# EAGLE design SDI12IB_v0.3 (EAGLE 5.11)
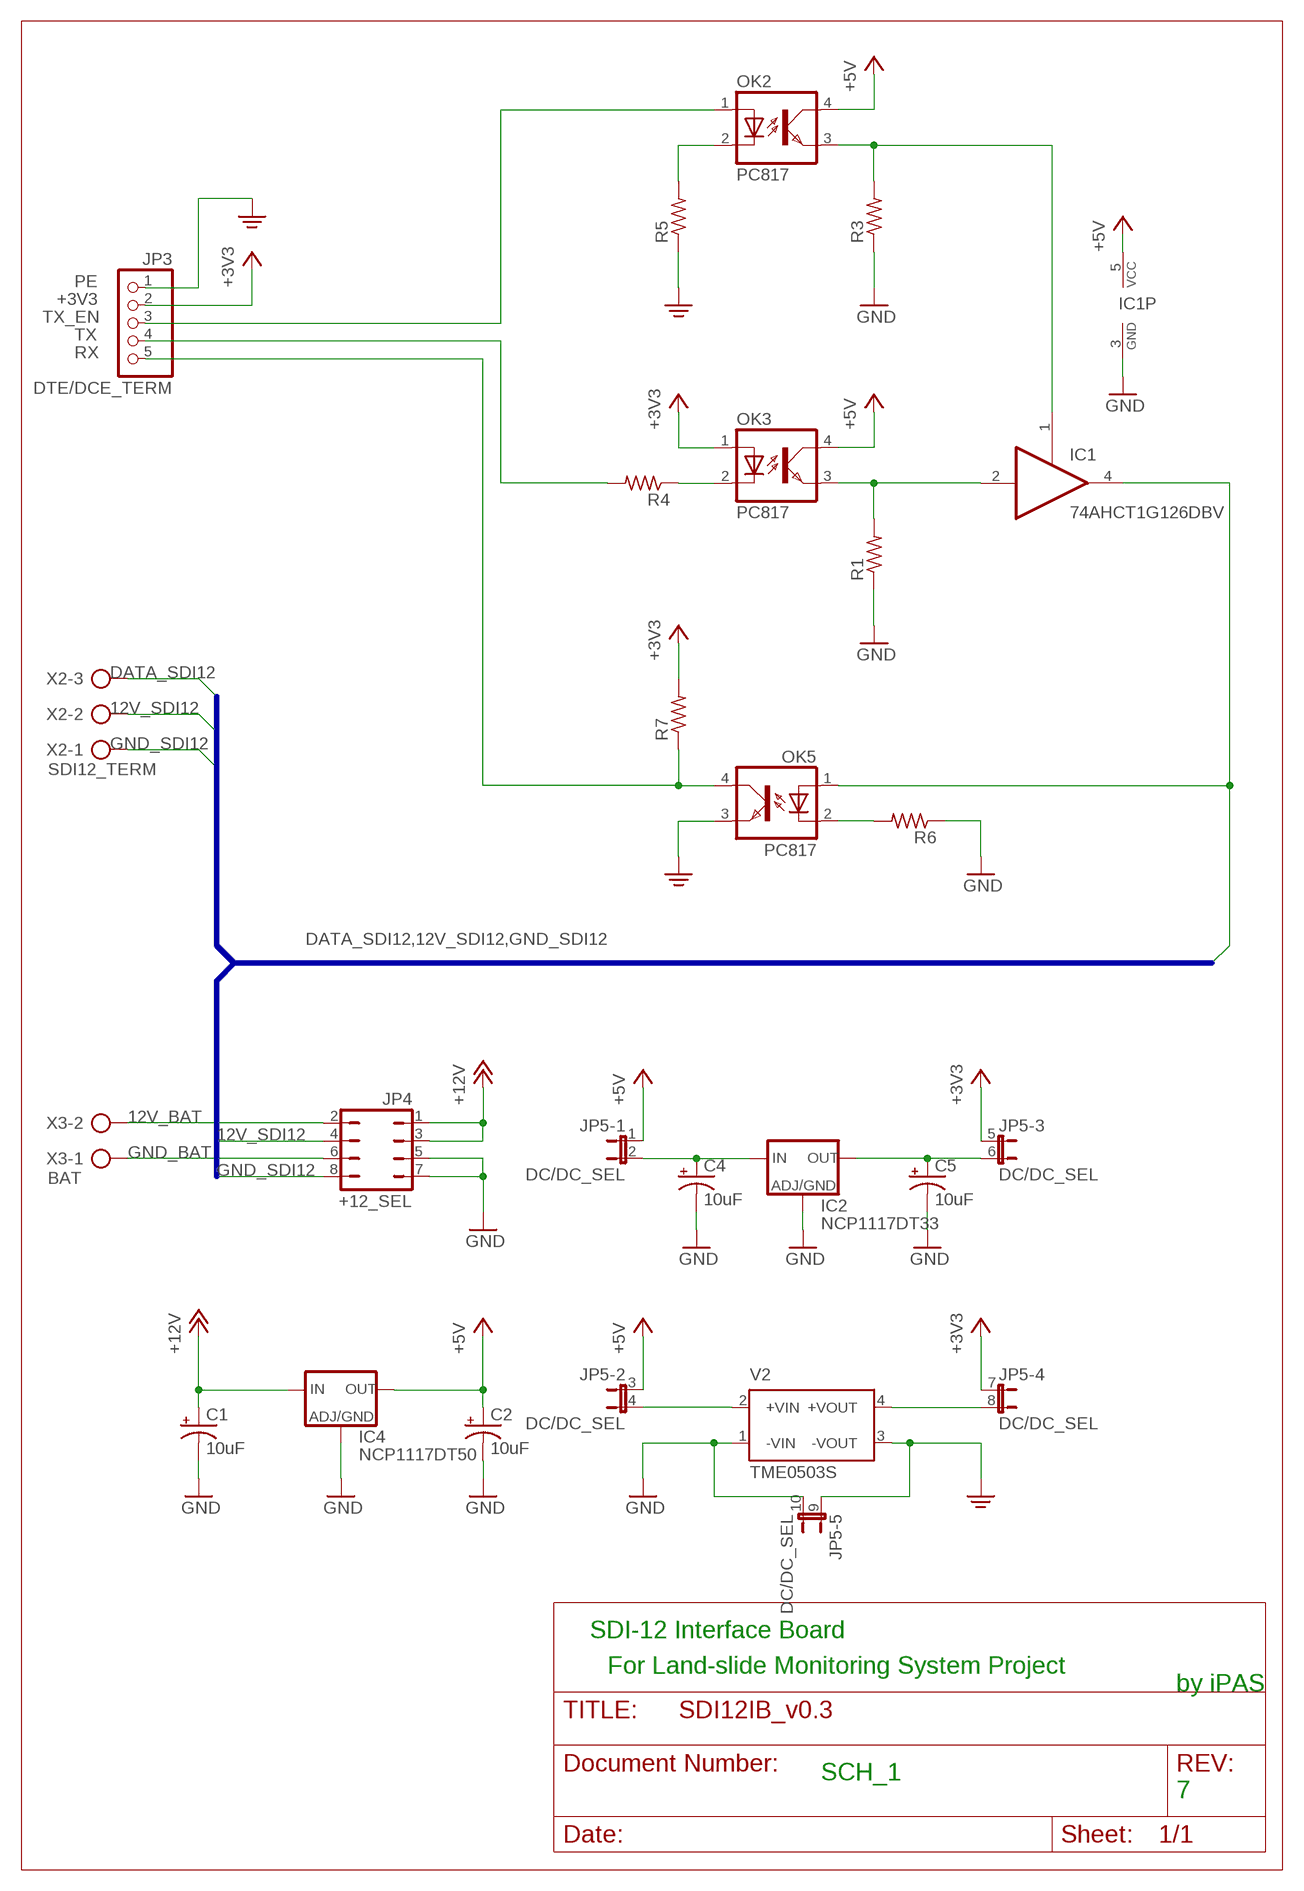
[diagram p0: schematic, sheet 1]

## Parts
C1  10uF  CPOL-USUD-5X5,8  [UD-5X5,8_NICHICON]
C2  10uF  CPOL-USUD-5X5,8  [UD-5X5,8_NICHICON]
C4  10uF  CPOL-USUD-5X5,8  [UD-5X5,8_NICHICON]
C5  10uF  CPOL-USUD-5X5,8  [UD-5X5,8_NICHICON]
IC1  74AHCT1G126DBV  [SOT23-5]
IC2  NCP1117DT33  [DPACK]
IC4  NCP1117DT50  [DPACK]
JP3  DTE/DCE_TERM  PINHD-1X5  [1X05]
JP4  +12_SEL  JP4Q  [JP4Q]
JP5  DC/DC_SEL  JP5QE  [JP5Q]
OK2  PC817  [DIL04]
OK3  PC817  [DIL04]
OK5  PC817  [DIL04]
R1  R-US_R0805  [R0805]
R3  R-US_R0805  [R0805]
R4  R-US_R0805  [R0805]
R5  R-US_R0805  [R0805]
R6  R-US_R0805  [R0805]
R7  R-US_R0805  [R0805]
V2  TME0503S  [TME]
X2  SDI12_TERM  AK300/3  [AK300/3]
X3  BAT  AK300/2  [AK300/2]

## Nets
12V_BAT: JP4.2 X3.2
12V_SDI12: JP4.4 X2.2
+3V3: JP3.2 JP5.5 JP5.7 OK3.1(A) R7.2
+5V: C2.+ IC1.5(VCC) IC4.4(OUT) JP5.1 JP5.3 OK2.4(COL) OK3.4(COL)
+12V: C1.+ IC4.3(IN) JP4.1 JP4.3
DATA_SDI12: IC1.4(O) OK5.1(A) X2.3
GND: C4.- C5.- R1.1 R3.1 R6.1
GND3.3: C1.- C2.- IC1.3(GND) IC2.1(ADJ) IC4.1(ADJ) JP4.5 JP4.7 JP5.10 V2.1(-VIN) ; supply symbol labelled GND
GND_BAT: JP4.6 X3.1
GND_SDI12: JP4.8 X2.1
N$1: C4.+ IC2.3(IN) JP5.2
N$2: JP5.4 V2.2(+VIN)
N$3: C5.+ IC2.4(OUT) JP5.6
N$4: IC1.2(I) OK3.3(EMIT) R1.2
N$5: OK3.2(C) R4.1
N$6: JP5.8 V2.4(+VOUT)
N$7: IC1.1(OE) OK2.3(EMIT) R3.2
N$8: OK2.2(C) R5.2
N$9: OK5.2(C) R6.2
PE: JP3.1 JP5.9 OK5.3(EMIT) R5.1 V2.3(-VOUT)
RX: JP3.5 OK5.4(COL) R7.1
TX: JP3.4 R4.2
TX_EN: JP3.3 OK2.1(A)

## Buses
DATA_SDI12,12V_SDI12,GND_SDI12

## Notes on the sheet
- SDI-12 Interface Board
- For Land-slide Monitoring System Project
- by iPAS
- SCH_1
- 7

## Library data of the parts
C1 C2 C4 C5 = rcl:CPOL-US: POLARIZED CAPACITOR, American symbol
IC1 = 74xx-little-us:74*1G126: Single Bus Buffer Gate With 3-State Outputs
IC2 IC4 = ipas:NCP1117?*: Low drop-out positive fixed and adjustable voltage regulator
JP3 = pinhead:PINHD-1X5: PIN HEADER
JP4 = jumper:JP4Q: JUMPER
JP5 = jumper:JP5QE: JUMPER
OK2 OK3 OK5 = optocoupler:PC817: SHARP OPTO COUPLER; MPN: PC817X4J000F; OC_FARNELL: 9707727; OC_NEWARK: 97K7059
R1 R3-R7 = rcl:R-US_: RESISTOR, American symbol
V2 = ipas:TME?*: DC/DC Converter TME Series 1 Watt Source: www.tracopower.com .. tme.pdf; MPN: TME 0503S
X2 = con-ptr500:AK300/3: CONNECTOR; OC_FARNELL: unknown; OC_NEWARK: unknown
X3 = con-ptr500:AK300/2: CONNECTOR; OC_FARNELL: unknown; OC_NEWARK: unknown

## Board
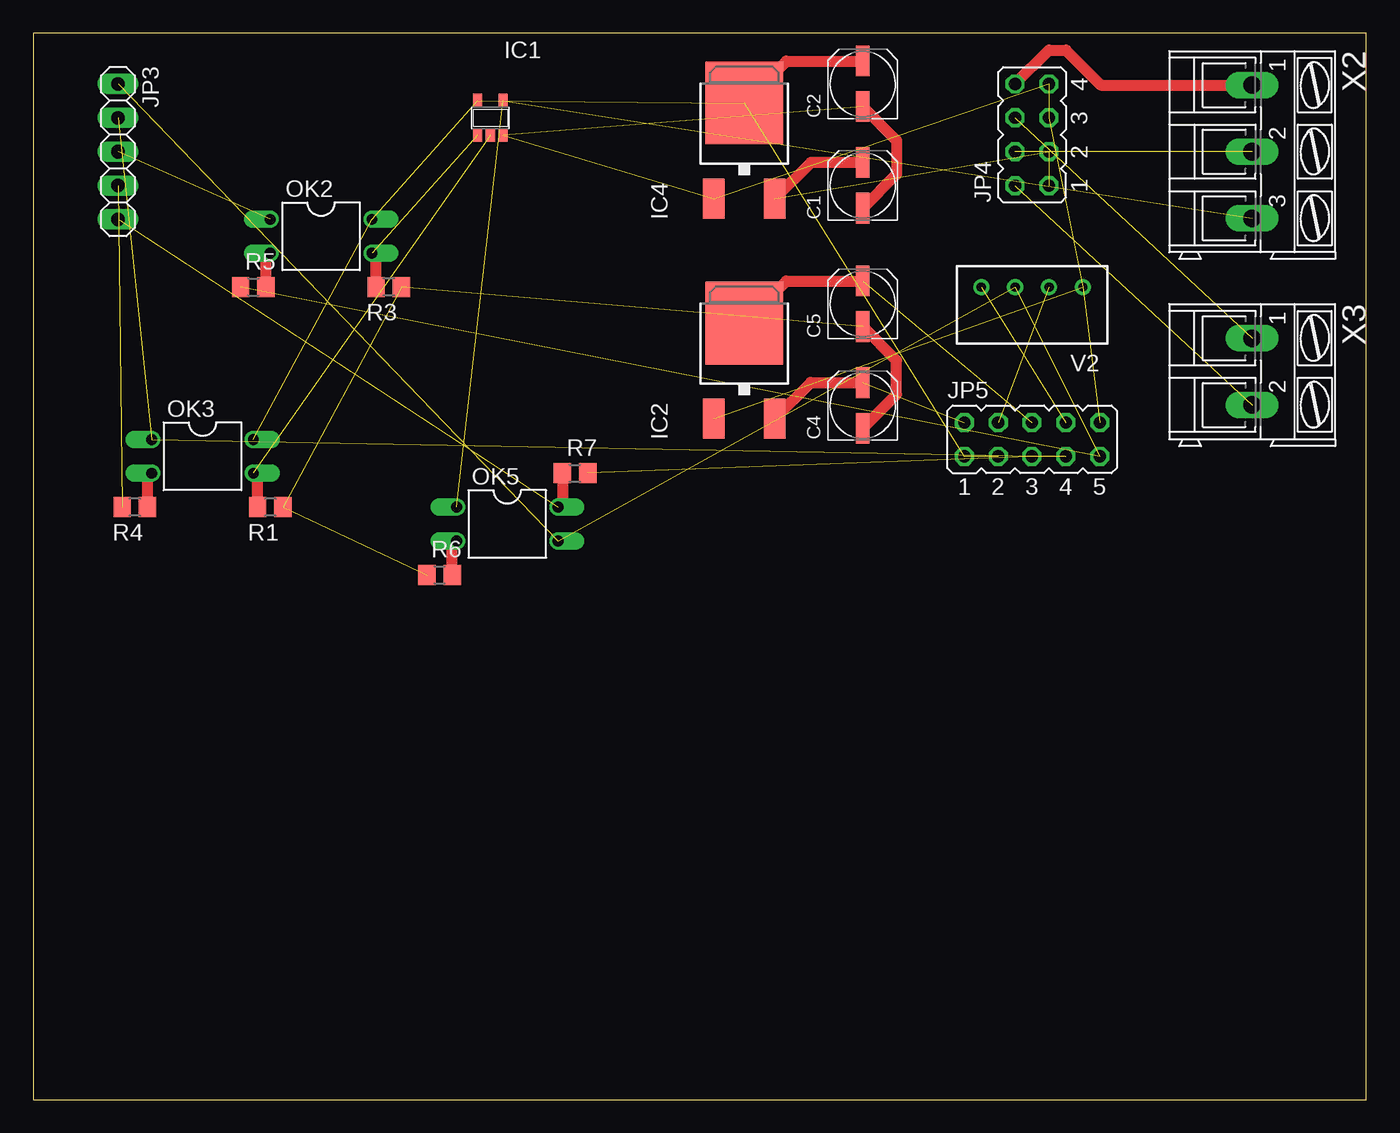
[diagram p1: board, top side]

Size 100 x 80 mm. Coordinates in mm from the lower left corner, seen from the top.
Outline: 0,0 100,0 100,80 0,80 0,0
Copper layers (1*16): Top 0.035mm / dielectric 1.5mm / Bottom 0.035mm
Design rules "default": minimum track width 10mil, minimum drill 24mil, track to track 8mil, track to pad 8mil, pad to pad 8mil, via to via 8mil, smd to smd 8mil, copper to edge 40mil, drill to drill 8mil, minimum pad ring 10mil, minimum via ring 8mil, stop-mask expansion 4mil, vias tented up to drill 0mil, thermal gap 10mil

### Footprints (pad centres in the part's own frame; a part is rotated, then mirrored left to right if it is on the bottom)
UD-5X5,8_NICHICON = smd 2.3 x 1: + 1.725,0; - -1.7,0
SOT23-5 = smd 0.69 x 0.99: 1 -0.95,-1.29; 2 0,-1.29; 3 0.95,-1.29; 4 0.95,1.3; 5 -0.95,1.3
DPACK = smd 1.6 x 3: 1 -2.28,-4.8; 3 2.28,-4.8 | smd 5.8 x 6.2: 4 0,2.38
1X05 = drill 1.016 long: 1 -5.08,0; 2 -2.54,0; 3 0,0; 4 2.54,0; 5 5.08,0
JP4Q = drill 0.914 octagon: 1 -3.81,-1.27; 2 -3.81,1.27; 3 -1.27,-1.27; 4 -1.27,1.27; 5 1.27,-1.27; 6 1.27,1.27; 7 3.81,-1.27; 8 3.81,1.27
JP5Q = drill 0.914 octagon: 1 -5.08,-1.27; 2 -5.08,1.27; 3 -2.54,-1.27; 4 -2.54,1.27; 5 0,-1.27; 6 0,1.27; 7 2.54,-1.27; 8 2.54,1.27; 9 5.08,-1.27; 10 5.08,1.27
DIL04 = drill 0.813 offset: 1 -1.27,-3.81; 2 1.27,-3.81; 3 1.27,3.81; 4 -1.27,3.81
R0805 = smd 1.3 x 1.5: 1 -0.95,0; 2 0.95,0
TME = drill 0.7 pad 1.1 round: 1 -3.81,0; 2 -1.27,0; 3 1.27,0; 4 3.81,0
AK300/3 = drill 1.321 long: 1 -5.004,0; 2 0,0; 3 5.004,0
AK300/2 = drill 1.321 long: 1 -2.515,0; 2 2.489,0

### Placement (x,y rotation side)
C1  62.23,68.58 90 top
C2  62.23,76.2 90 top
C4  62.23,52.07 90 top
C5  62.23,59.69 90 top
IC1  34.29,73.66 0 top
IC2  53.34,55.88 0 top
IC4  53.34,72.39 0 top
JP3  6.35,71.12 270 top
JP4  74.93,72.39 90 top
JP5  74.93,49.53 0 top
OK2  21.59,64.77 270 top
OK3  12.7,48.26 270 top
OK5  35.56,43.18 270 top
R1  17.78,44.45 180 top
R3  26.67,60.96 180 top
R4  7.62,44.45 180 top
R5  16.51,60.96 0 top
R6  30.48,39.37 0 top
R7  40.64,46.99 0 top
V2  74.93,60.96 180 top
X2  91.44,71.12 270 top
X3  91.44,54.61 270 top

### Tracks (layer width: path | path; a pad name or v marks a point on that pad's centre or on a via)
12V_BAT  (1 unrouted)
12V_SDI12  (1 unrouted)
+3V3  (4 unrouted)
+5V  (5 unrouted)
  Top 0.813: C2.+ 56.49,77.92 IC4.4
+12V  (2 unrouted)
  Top 0.813: C1.+ 58.34,70.31 IC4.3
DATA_SDI12  (2 unrouted)
GND  (3 unrouted)
  Top 0.813: C4.- 64.77,52.91 64.77,55.45 C5.-
GND3.3  (7 unrouted)
  Top 0.813: C1.- 64.77,69.42 64.77,71.96 C2.-
GND_BAT  (1 unrouted)
GND_SDI12
  Top 0.813: JP4.8 76.2,78.74 77.47,78.74 80.09,76.12 X2.1
N$1  (1 unrouted)
  Top 0.813: IC2.3 58.34,53.8 C4.+
N$2  (1 unrouted)
N$3  (1 unrouted)
  Top 0.813: C5.+ 56.49,61.41 IC2.4
N$4  (1 unrouted)
  Top 0.813: R1.2 16.83,46.99 OK3.3
N$5
  Top 0.813: R4.1 8.57,46.99 OK3.2
N$6  (1 unrouted)
N$7  (1 unrouted)
  Top 0.813: R3.2 25.72,63.5 OK2.3
N$8
  Top 0.813: R5.2 17.46,63.5 OK2.2
N$9
  Top 0.813: R6.2 31.43,41.91 OK5.2
PE  (4 unrouted)
RX  (1 unrouted)
  Top 0.813: R7.1 39.69,44.45 OK5.4
TX  (1 unrouted)
TX_EN  (1 unrouted)